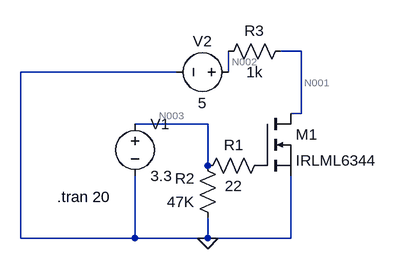
[diagram p0: schematic Logica con transistores.asc]
Logica con transistores.asc, the LTspice schematic file:
Version 4
SHEET 1 1780 680
WIRE 320 16 288 16
WIRE 128 48 -112 48
WIRE 208 48 208 16
WIRE 320 112 320 16
WIRE 320 112 304 112
WIRE 176 128 64 128
WIRE 176 192 176 128
WIRE -112 304 -112 48
WIRE 64 304 64 208
WIRE 64 304 -112 304
WIRE 176 304 176 272
WIRE 176 304 64 304
WIRE 304 304 304 208
WIRE 304 304 176 304
FLAG 176 304 0
SYMBOL voltage 64 112 R0
WINDOW 123 0 0 Left 0
WINDOW 39 0 0 Left 0
SYMATTR InstName V1
SYMATTR Value 3.3
SYMBOL res 272 176 R90
WINDOW 0 0 56 VBottom 2
WINDOW 3 32 56 VTop 2
SYMATTR InstName R1
SYMATTR Value 22
SYMBOL res 192 288 R180
WINDOW 0 36 76 Left 2
WINDOW 3 36 40 Left 2
SYMATTR InstName R2
SYMATTR Value 47K
SYMBOL voltage 224 48 R90
WINDOW 0 -32 56 VBottom 2
WINDOW 3 32 56 VTop 2
WINDOW 123 0 0 Left 0
WINDOW 39 0 0 Left 0
SYMATTR InstName V2
SYMATTR Value 5
SYMBOL nmos 256 112 R0
SYMATTR InstName M1
SYMATTR Value IRLML6344
SYMBOL res 304 0 R90
WINDOW 0 0 56 VBottom 2
WINDOW 3 32 56 VTop 2
SYMATTR InstName R3
SYMATTR Value 1k
TEXT -56 240 Left 2 !.tran 20

The netlist it stands for:
* Logica con transistores.asc
V1 N003 0 3.3
R1 P001 N003 22
R2 0 N003 47K
V2 N002 0 5
M1 N001 P001 0 0 IRLML6344
R3 N001 N002 1k
.model NMOS NMOS
.model PMOS PMOS
.lib standard.mos
.tran 20
.backanno
.end

* Results of the author's LTspice run, read from the files saved beside the schematic
* Operating Point, zero values left out:
*   V(n003) = 3.3 V
*   V(p001) = 3.3 V
*   V(n002) = 5 V
*   V(n001) = 136 µV
*   Id(M1) = 5 mA
*   Is(M1) = -5 mA
*   I(R3) = -5 mA
*   I(R2) = -70.21 µA
*   I(V2) = -5 mA
*   I(V1) = -70.21 µA